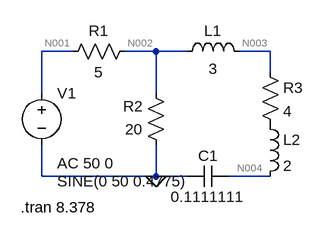
[diagram p0: schematic Task1-2.asc]
Task1-2.asc, the LTspice schematic file:
Version 4
SHEET 1 880 680
WIRE 176 48 128 48
WIRE 304 48 256 48
WIRE 352 48 304 48
WIRE 480 48 432 48
WIRE 480 80 480 48
WIRE 128 112 128 48
WIRE 304 112 304 48
WIRE 128 240 128 192
WIRE 304 240 304 192
WIRE 304 240 128 240
WIRE 352 240 304 240
WIRE 480 240 416 240
FLAG 304 240 0
SYMBOL voltage 128 96 R0
WINDOW 123 24 124 Left 2
WINDOW 39 0 0 Left 0
WINDOW 3 24 152 Left 2
SYMATTR Value2 AC 50 0
SYMATTR Value SINE(0 50 0.4775)
SYMATTR InstName V1
SYMBOL res 272 32 R90
WINDOW 0 0 56 VBottom 2
WINDOW 3 32 56 VTop 2
SYMATTR InstName R1
SYMATTR Value 5
SYMBOL res 320 208 R180
WINDOW 0 36 76 Left 2
WINDOW 3 36 40 Left 2
SYMATTR InstName R2
SYMATTR Value 20
SYMBOL ind 336 64 R270
WINDOW 0 32 56 VTop 2
WINDOW 3 5 56 VBottom 2
SYMATTR InstName L1
SYMATTR Value 3
SYMBOL cap 416 224 R90
WINDOW 0 0 32 VBottom 2
WINDOW 3 32 32 VTop 2
SYMATTR InstName C1
SYMATTR Value 0.1111111
SYMBOL res 464 64 R0
SYMATTR InstName R3
SYMATTR Value 4
SYMBOL ind 464 144 R0
SYMATTR InstName L2
SYMATTR Value 2
TEXT 96 288 Left 2 !.tran 8.378

The netlist it stands for:
* Task1-2.asc
V1 N001 0 SINE(0 50 0.4775) AC 50 0
R1 N002 N001 5
R2 0 N002 20
L1 N002 N003 3
C1 N004 0 0.1111111
R3 N003 P001 4
L2 P001 N004 2
.tran 8.378
.backanno
.end

* Results of the author's LTspice run, read from the files saved beside the schematic
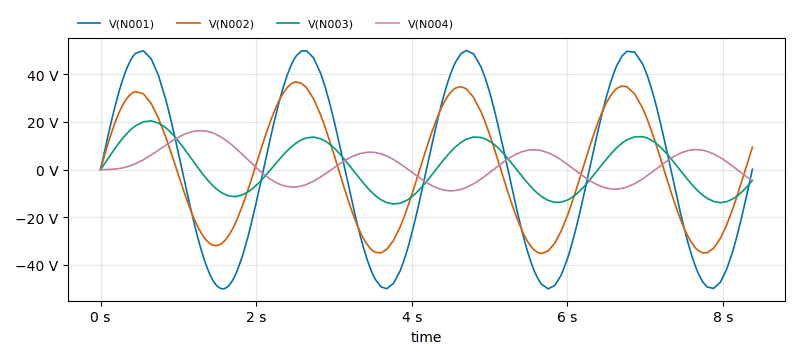
[diagram p1: Transient Analysis of Task1-2.asc, plotted from the saved traces]
* Transient Analysis, 1 run:
*   V(N001): min -50 V, max 49.97 V, average -16.57 mV, rms 35.28 V, last 155.5 mV
*   V(N002): min -35.19 V, max 36.75 V, average 234.9 mV, rms 24.34 V, last 9.349 V
*   V(N003): min -14.44 V, max 20.38 V, average 1.066 V, rms 10.48 V, last -4.574 V
*   V(N004): min -8.906 V, max 16.3 V, average 1.869 V, rms 6.976 V, last -4.63 V